# EAGLE design UP-Universaltasterschnittstelle (EAGLE 5.02)
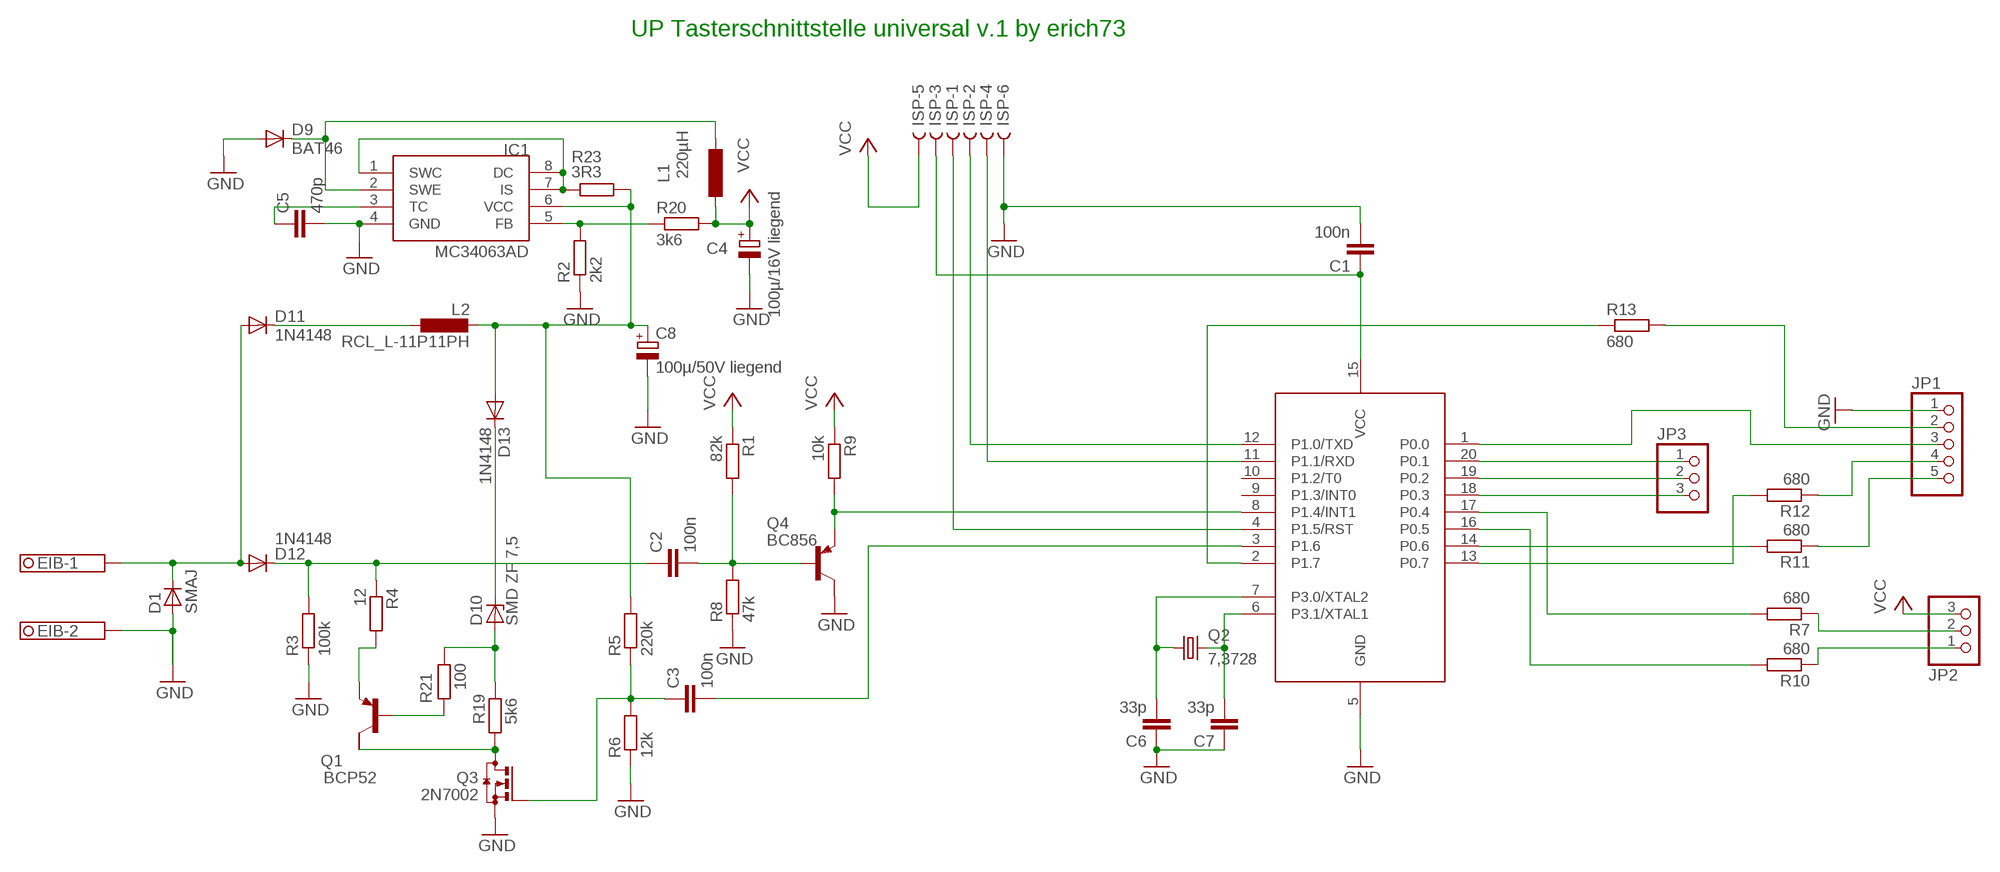
[diagram p0: schematic, sheet 1]

## Parts
C1  100n  C-EUC1206  [C1206]
C2  100n  C-EUC1206  [C1206]
C3  100n  C-EUC1206  [C1206]
C4  100µ/16V liegend  RCL_C_EU_H2-5X11  [2-5X11]
C5  470p  C-EUC1206  [C1206]
C6  33p  C-EUC0805  [C0805]
C7  33p  C-EUC0805  [C0805]
C8  100µ/50V liegend  RCL_C_EU_H3,5-8X13  [3,5-8X13]
D1  SMAJ  D-SMB  [SMB]
D9  BAT46  DIODE-MINIMELF  [MINIMELF]
D10  SMD ZF 7,5  ZPD  [MINIMELF]
D11  1N4148  DIODE-MINIMELF  [MINIMELF]
D12  1N4148  DIODE-MINIMELF  [MINIMELF]
D13  1N4148  DIODE-MINIMELF  [MINIMELF]
EIB  1751248  [1751248]
IC1  MC34063AD  [SOIC8]
IC2  LPC922FDH  [TSSOP20]
ISP-  6  [6]
JP1  PINHD-1X5_2.00  [1X05M]
JP2  PINHD-1X3_2.00  [1X03M]
JP3  PINHD-1X3_2.00  [1X03M]
L1  220µH  L-EU2200-11.43  [2200-11.43]
L2  RCL_L-11P11PH  [RCL_11PH]
Q1  BCP52  FZT753SMD  [SOT223]
Q2  7,3728  CRYSTAL_CRYSTALHC49S  [CRYSTAL_HC49/S]
Q3  2N7002  BSS123  [SOT23]
Q4  BC856  BC856ALT1SMD  [SOT23-BEC]
R1  82k  R-EU_R1206  [R1206]
R2  2k2  R-EU_R1206  [R1206]
R3  100k  R-EU_M1206  [M1206]
R4  12  R-EU_R1206  [R1206]
R5  220k  R-EU_R1206  [R1206]
R6  12k  R-EU_M1206  [M1206]
R7  680  R-EU_R0805  [R0805]
R8  47k  R-EU_M1206  [M1206]
R9  10k  R-EU_R1206  [R1206]
R10  680  R-EU_R0805  [R0805]
R11  680  R-EU_R0805  [R0805]
R12  680  R-EU_R0805  [R0805]
R13  680  R-EU_R0805  [R0805]
R19  5k6  R-EU_M1206  [M1206]
R20  3k6  R-EU_M1206  [M1206]
R21  100  R-EU_R1206  [R1206]
R23  3R3  R-EU_M1206  [M1206]

## Nets
GND: C1.2 C4.- C5.2 C6.1 C7.1 C8.- D1.2(A) D9.A EIB.2 IC1.4(GND) IC2.5(GND) ISP-.6 JP1.1 Q3.2(S) Q4.C R2.1 R3.1 R6.1 R8.1
N$1: C1.1 IC2.15(VCC) ISP-.3
N$2: IC2.4(P1.5/RST) ISP-.1
N$3: IC2.12(P1.0/TXD) ISP-.2
N$4: IC2.11(P1.1/RXD) ISP-.4
N$5: C7.2 IC2.6(P3.1/XTAL1) Q2.2
N$6: C6.2 IC2.7(P3.0/XTAL2) Q2.1
N$7: IC2.1(P0.0) JP1.3
N$8: IC2.20(P0.1) JP3.1
N$9: IC2.19(P0.2) JP3.2
N$10: IC2.18(P0.3) JP3.3
N$11: IC2.17(P0.4) R7.2
N$12: C8.+ D13.A IC1.6(VCC) L2.P$2 R5.2 R23.2
N$13: JP2.2 R7.1
N$14: IC2.16(P0.5) R10.2
N$15: IC2.14(P0.6) R11.2
N$16: IC2.13(P0.7) R12.2
N$17: JP2.1 R10.1
N$18: JP1.5 R11.1
N$19: IC2.8(P1.4/INT1) Q4.E R9.2
N$20: JP1.4 R12.1
N$21: IC2.2(P1.7) R13.1
N$22: JP1.2 R13.2
N$23: C2.2 Q4.B R1.2 R8.2
N$24: C3.2 IC2.3(P1.6)
N$25: C2.1 D12.C R3.2 R4.1
N$26: IC1.5(FB) R2.2 R20.1
N$27: D9.C IC1.2(SWE) L1.2
N$28: C5.1 IC1.3(TC)
N$34: C3.1 Q3.1(G) R5.1 R6.2
N$36: D11.C L2.P$1
N$37: Q1.2(C) Q3.3(D) R19.1
N$38: D10.A R19.2 R21.1
N$39: Q1.3(E) R4.2
N$40: Q1.1(B) R21.2
N$41: D10.C D13.C
N$51: D1.1(C) D11.A D12.A EIB.1
N$61: IC1.1(SWC) IC1.7(IS) IC1.8(DC) R23.1
VCC: C4.+ ISP-.5 JP2.3 L1.1 R1.1 R9.1 R20.2
Unconnected: IC2.9(P1.3/INT0) IC2.10(P1.2/T0) Q1.4(C/)

## Notes on the sheet
- UP Tasterschnittstelle universal v.1 by erich73

## Library data of the parts
C1-C3 C5-C7 = rcl:C-EU: CAPACITOR, European symbol
C4 C8 = LPC_Gira3:RCL_C_EU_H
D1 = semicon-smd-ipc:D-: DIODE unfilled
D9 D11-D13 = diode:DIODE-: DIODE
D10 = diode:ZPD: Z DIODE 500 mW
EIB = con-phoenix-350:1751248: MKDS 1/ 2-3,5 Printklemme Nennstrom: 10 A Bemessungsspannung: 160 V Raster: 3,5 mm Polzahl: 2 Montageart: Löten Anschlussart: Schraubanschluss Anschlussrichtung vom Leiter zur Platine: 0° Source: http://eshop.phoenixcontact.com .. 1751248.pdf
IC1 = mc34063:MC34063
IC2 = LPCGira:LPC922FDH
ISP- = con-leotronics:6
JP1 = pinhead2:PINHD-1X5: PIN HEADER
JP2 JP3 = pinhead2:PINHD-1X3: PIN HEADER
L1 = rcl:L-EU: INDUCTOR, European symbol
L2 = LPC_Gira3:RCL_L-11P
Q1 = transistor-pnp:FZT753SMD: PNP Transistor
Q2 = LPCGira:CRYSTAL_CRYSTAL: CRYSTAL
Q3 = transistor-small-signal:BSS123: N-CHANNEL MOS FET
Q4 = transistor-pnp:BC856*: PNP Transistror
R1-R13 R19-R21 R23 = rcl:R-EU_: RESISTOR, European symbol

## Board
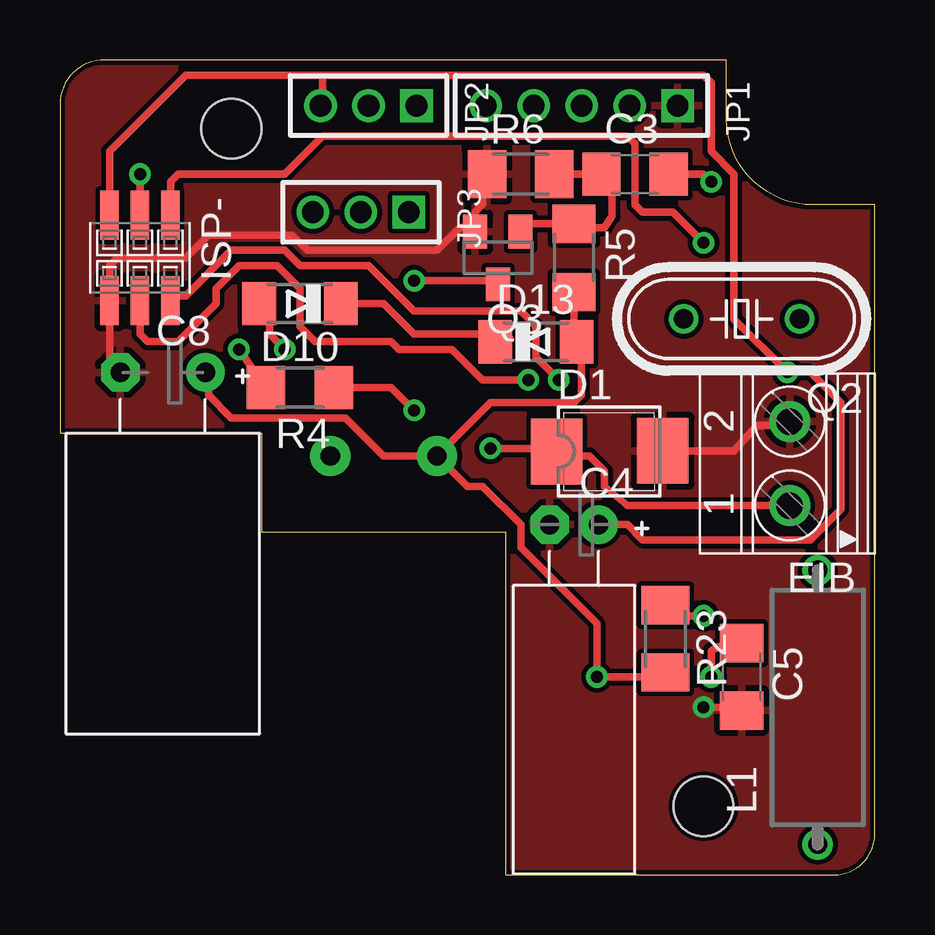
[diagram p1: board, top side]
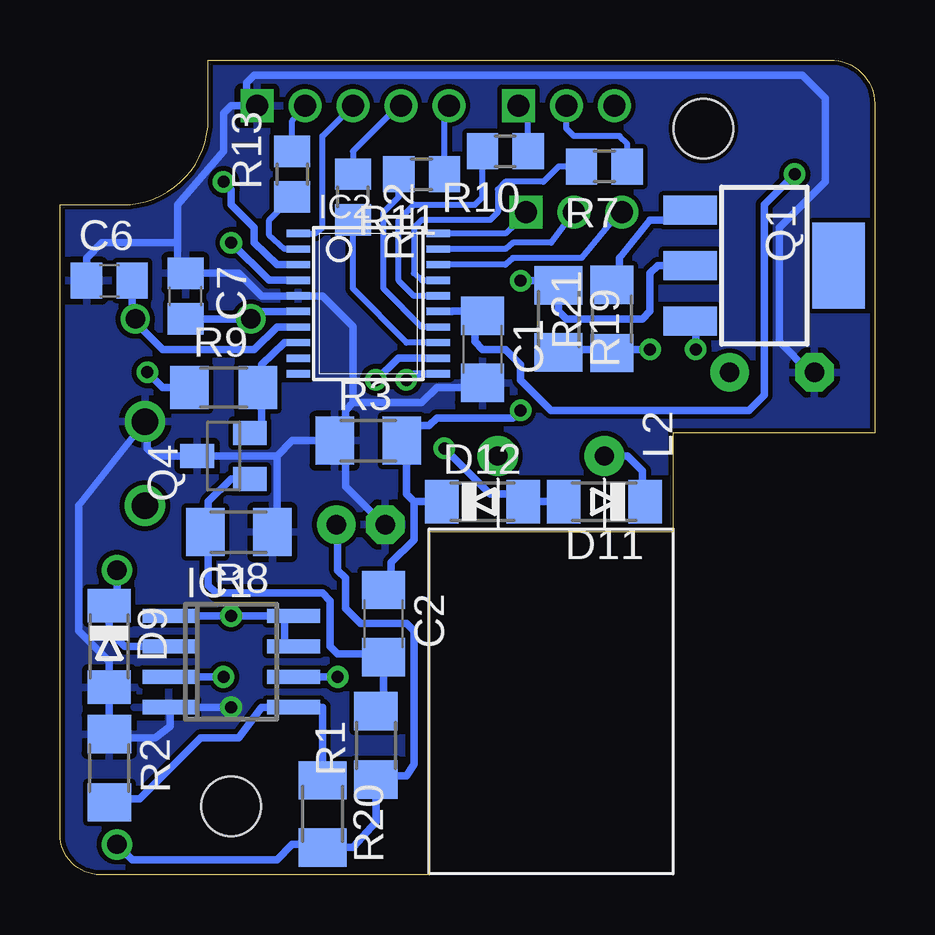
[diagram p2: board, bottom side, seen from below]

Size 33.97 x 33.97 mm. Coordinates in mm from the lower left corner, seen from the top.
Outline: 0.01,18.42 8.41,18.42 8.41,14.29 18.57,14.29 18.57,0 32.29,0.01 arc90 33.97,1.68 33.97,27.93 31.38,27.93 arc-90 27.78,31.53 27.78,33.97 1.69,33.97 arc90 0.01,31.97 0.01,18.42
Copper layers (1*16): Top 0.035mm / dielectric 1.5mm / Bottom 0.035mm
Design rules "ZWILLING": minimum track width 0.2mm, minimum drill 0.5mm, track to track 0.2mm, track to pad 0.2mm, pad to pad 0.2mm, via to via 0.2mm, smd to smd 0mil, copper to edge 0.2mm, drill to drill 0.2mm, minimum pad ring 0.2mm, minimum via ring 0.2mm, stop-mask expansion 0.1mm, vias tented up to drill 0mil, thermal gap 10mil
Holes 2.49 mm at 7.14,31.11 26.83,2.86

### Footprints (pad centres in the part's own frame; a part is rotated, then mirrored left to right if it is on the bottom)
C1206 = smd 1.6 x 1.8: 1 -1.4,0; 2 1.4,0
2-5X11 = drill 0.813 pad 1.6 round: + -1.02,0 | drill 0.813 pad 1.6 octagon: - 1.02,0
C0805 = smd 1.3 x 1.5: 1 -0.95,0; 2 0.95,0
3,5-8X13 = drill 0.813 pad 1.6 round: + -1.77,-0.31 | drill 0.813 pad 1.6 octagon: - 1.77,-0.31
SMB = smd 2.159 x 2.743: 1 -2.311,-0.127; 2 2.108,-0.102
MINIMELF = smd 1.4 x 1.8: A 1.7,0; C -1.7,0
1751248 = drill 1.1 pad 1.7 round: 1 -1.75,-0.1; 2 1.75,-0.1
SOIC8 = smd 0.6 x 2.2: 1 -1.905,-2.6; 2 -0.635,-2.6; 3 0.635,-2.6; 4 1.905,-2.6; 5 1.905,2.6; 6 0.635,2.6; 7 -0.635,2.6; 8 -1.905,2.6
TSSOP20 = smd 0.305 x 0.991: 1 -2.925,-2.918; 2 -2.275,-2.918; 3 -1.625,-2.918; 4 -0.975,-2.918; 5 -0.325,-2.918; 6 0.325,-2.918; 7 0.975,-2.918; 8 1.625,-2.918; 9 2.275,-2.918; 10 2.925,-2.918; 11 2.925,2.918; 12 2.275,2.918; 13 1.625,2.918; 14 0.975,2.918; 15 0.325,2.918; 16 -0.325,2.918; 17 -0.975,2.918; 18 -1.625,2.918; 19 -2.275,2.918; 20 -2.925,2.918
6 = smd 0.76 x 2.05: 1 -1.905,-1.78; 2 -1.905,1.78; 3 -0.635,-1.78; 4 -0.635,1.78; 5 0.635,-1.78; 6 0.635,1.78
1X05M = drill 0.914 square: 1 -4,0 | drill 0.914 round: 2 -2,0; 3 0,0; 4 2,0; 5 4,0
1X03M = drill 0.914 square: 1 -2,0 | drill 0.914 round: 2 0,0; 3 2,0
2200-11.43 = drill 0.8 pad 1.27 round: 1 -5.715,0; 2 5.715,0
RCL_11PH = drill 0.8 pad 1.676 round: P$1 -2.223,0; P$2 2.223,0
SOT223 = smd 1.219 x 2.235: 1 -2.311,-3.099; 2 0,-3.099; 3 2.311,-3.099 | smd 3.6 x 2.2: 4 0,3.099
CRYSTAL_HC49/S = drill 0.813 round: 1 -2.413,0; 2 2.413,0
SOT23 = smd 1 x 1.4: 1 -0.95,-1.1; 2 0.95,-1.1; 3 0,1.1
SOT23-BEC = smd 1 x 1.4: B -0.95,-1.1; C 0,1.1; E 0.95,-1.1
R1206 = smd 1.6 x 1.803: 1 -1.422,0; 2 1.422,0
M1206 = smd 1.6 x 2: 1 -1.4,0; 2 1.4,0
R0805 = smd 1.3 x 1.5: 1 -0.95,0; 2 0.95,0

### Placement (x,y rotation side)
C1  16.35,21.91 270 bottom
C2  20.48,10.48 270 bottom
C3  23.97,29.21 0 top
C4  21.43,14.61 180 top
C5  28.42,8.26 270 top
C6  31.91,24.77 0 bottom
C7  28.73,24.13 270 bottom
C8  4.29,20.64 180 top
D1  23.02,17.78 0 top
D9  31.91,9.53 270 bottom
D10  10,23.81 180 top
D11  11.27,15.56 180 bottom
D12  16.35,15.56 0 bottom
D13  19.84,22.23 0 top
EIB  30.32,17.14 90 top
IC1  26.83,8.89 270 bottom
IC2  21.11,23.81 270 bottom
ISP-  2.7,25.72 180 top
JP1  21.75,32.07 180 top
JP2  12.86,32.07 180 top
JP3  12.54,27.62 180 top
L1  31.59,6.99 90 top
L2  13.49,17.46 180 bottom
Q1  4.6,25.4 270 bottom
Q2  28.42,23.18 180 top
Q3  18.26,25.72 180 top
Q4  27.15,17.46 90 bottom
R1  20.8,5.4 90 bottom
R2  31.91,4.45 270 bottom
R3  21.11,18.1 0 bottom
R4  10,20.32 180 top
R5  21.43,25.72 270 top
R6  19.21,29.21 0 top
R7  11.27,29.53 180 bottom
R8  26.51,14.29 180 bottom
R9  27.15,20.32 0 bottom
R10  15.4,30.16 180 bottom
R11  18.89,29.21 180 bottom
R12  21.75,28.26 270 bottom
R13  24.29,29.21 90 bottom
R19  13.18,23.18 270 bottom
R20  23.02,2.54 270 bottom
R21  10.95,23.18 90 bottom
R23  25.24,9.84 270 top

### Tracks (layer width: path | path; a pad name or v marks a point on that pad's centre or on a via)
GND  (via drill 0.5)
  Top 0.305: 17.94,29.04 17.94,28.89 | Q3.2 17.3,26.99 | 17.3,26.99 17.3,27.62 17.62,27.94 17.62,28.26 17.94,29.04 | R6.1 17.94,29.21 17.94,29.04 | C8.- 2.06,21.58 ISP-.6 2.06,25.4 2.38,25.72 5.24,25.72 6.19,26.67 9.68,26.67 10.32,26.04 15.72,26.04 16.67,26.99 17.3,26.99 | D1.2 28.1,17.68 29.05,18.73 30.32,18.73 30.32,18.89 EIB.2 | v26.83,6.99 28.42,6.99 C5.2 28.42,6.67
  Bottom 0.305: 21.75,19.68 21.75,22.86 23.02,24.14 IC2.5 25.56,24.14 26.51,25.08 C7.1 29.05,25.08 29.05,26.35 | C6.1 32.86,25.72 32.23,26.35 29.05,26.35 | 29.05,26.35 29.05,27.94 27.15,30.16 27.15,31.75 26.83,32.07 26.19,32.07 | 31.91,7.94 31.91,8.89 33.18,10.16 33.18,15.4 EIB.2 30.32,18.89 30.32,17.78 30,17.46 Q4.C | Q4.C 28.1,17.46 | R8.1 24.92,14.29 24.92,17.46 | 24.92,17.46 Q4.C | C4.- 20.48,14.61 22.07,16.19 22.07,18.1 | 26.19,32.07 26.19,33.02 25.88,33.34 3.02,33.34 2.06,32.38 2.06,28.89 3.97,26.99 3.97,22.23 2.7,20.95 C8.- | 26.19,32.07 JP1.1 | 29.37,6.99 IC1.4 | 29.37,6.99 29.37,6.18 30,5.71 31.91,5.71 R2.1 31.91,7.94 | 31.91,7.94 D9.A | 29.37,6.99 v26.83,6.99 | 22.07,18.1 R3.1 24.29,18.1 24.92,17.46 | 22.07,18.1 22.07,19.37 21.75,19.68 | 21.75,19.68 18.89,19.68 18.26,20.32 16.35,20.32 C1.2
  pour Top: -0.16,33.97 34.13,33.97 34.13,1.91 34.13,0 -0.16,0
  pour Bottom: -0.16,33.97 34.13,33.97 34.13,3.17 34.13,0 -0.16,0
N$1  (via drill 0.5)
  Top 0.305: v3.33,29.21 ISP-.3
  Bottom 0.305: IC2.15 17.62,23.49 17.62,23.5 16.67,23.5 | 16.67,23.5 C1.1 | 16.67,23.5 16.67,22.23 16.35,21.91 15.4,21.91 14.76,21.27 14.76,20.64 13.49,19.37 5.24,19.37 4.6,20 4.6,27.94 v3.33,29.21
N$2  (via drill 0.5)
  Top 0.305: v26.83,26.35 25.56,27.62 24.29,27.62 23.97,27.94 23.97,30.48 23.65,30.8 10.95,30.8 9.37,29.21 4.92,29.21 4.6,28.89 ISP-.1
  Bottom 0.305: IC2.4 25.24,24.79 v26.83,26.35
N$3  (via drill 0.5)
  Top 0.305: v20.8,20.64 19.84,21.59 19.84,22.86 19.21,23.5 14.76,23.5 12.86,25.4 10,25.4 9.37,26.04 7.14,26.04 5.24,24.13 4.6,24.13 ISP-.2
  Bottom 0.305: IC2.12 19.84,21.54 v20.8,20.64
N$4  (via drill 0.5)
  Top 0.305: v19.53,20.64 17.62,20.64 16.35,21.91 14.13,21.91 13.81,22.23 10.64,22.23 10,22.86 10,24.45 9.05,25.4 7.46,25.4 6.51,24.45 6.51,23.81 4.92,22.23 3.65,22.23 3.33,22.54 ISP-.4 3.33,24.13
  Bottom 0.305: IC2.11 19.21,20.89 v19.53,20.64
N$5
  Bottom 0.254: 25.88,23.18 Q2.2 | C7.2
  Bottom 0.305: IC2.6 25.56,23.49 25.88,23.18 | Q2.2 C7.2
N$6
  Bottom 0.254: 30.64,22.86 Q2.1
  Bottom 0.305: C6.2 30.96,23.18 30.64,22.86 29.69,21.91 25.88,21.91 24.92,22.84 IC2.7
N$7
  Bottom 0.254: IC2.1 23.34,26.74 23.02,26.99 23.02,30.8 JP1.3
N$8
  Bottom 0.254: IC2.20 15.4,26.74 14.45,27.62 JP3.1
N$9
  Bottom 0.254: 18.26,26.09 IC2.19 15.4,26.09 15.08,26.35 13.49,26.35 JP3.2
N$10
  Bottom 0.254: IC2.18 15.4,25.44 15.08,25.72 12.22,25.72 10.64,27.62 JP3.3
N$11
  Bottom 0.254: IC2.17 18.89,24.79 19.21,25.08 19.21,26.99 18.89,27.3 16.03,27.3 15.72,27.62 15.72,28.57 15.4,28.89 13.81,28.89 13.18,29.53 R7.2
N$12  (via drill 0.5)
  Top 0.305: R5.2 21.43,22.23 D13.A 21.75,22.23 21.75,20 21.43,19.68 17.94,19.68 L2.P$2 | R23.2 25.24,8.26 v22.38,8.26 22.38,10.48 19.21,13.65 19.21,14.61 17.62,16.19 16.99,16.19 L2.P$2 | L2.P$2 13.49,17.46 11.91,19.05 7.14,19.05 6.19,20 6.19,20.95 | 6.19,20.95 | 6.19,20.95 C8.+
  Bottom 0.305: v22.38,8.26 IC1.6
N$13
  Bottom 0.254: R7.1 10.32,30.48 10.64,30.8 12.54,30.8 12.86,31.11 JP2.2
N$14
  Bottom 0.254: IC2.16 19.21,24.13 19.84,24.77 19.84,27.3 19.21,27.94 16.67,27.94 16.35,28.26 R10.2
N$15
  Bottom 0.254: IC2.14 18.89,22.84 20.48,24.45 20.48,27.62 19.84,28.26 19.84,28.57 R11.2
N$16
  Bottom 0.254: IC2.13 19.53,22.19 21.75,24.45 R12.2
N$17
  Bottom 0.254: R10.1 14.45,31.75 JP2.1
N$18
  Bottom 0.254: R11.1 17.94,29.52 17.94,31.43 17.62,32.07 JP1.5
N$19
  Bottom 0.305: IC2.8 24.61,22.19 25.56,21.27 25.56,19.37 | 25.56,19.37 R9.2 | Q4.E 25.56,18.41 25.56,19.37
N$20
  Bottom 0.254: R12.1 21.75,30.16 19.84,32.07 JP1.4
N$21
  Bottom 0.254: IC2.2 24.61,26.09 25.24,26.67 25.24,27.3 R13.1
N$22
  Bottom 0.254: JP1.2 23.65,32.07 24.29,31.43 R13.2
N$23
  Bottom 0.305: Q4.B 26.83,16.51 27.78,15.56 27.78,14.29 | 27.78,14.29 R8.2 | 27.78,14.29 27.78,12.06 27.46,11.75 23.02,11.75 22.7,11.43 22.7,9.53 22.38,9.21 20.8,9.21 C2.2 20.48,7.3 20.48,6.82 R1.2 20.48,6.67
N$24  (via drill 0.5)
  Top 0.305: v27.15,28.89 26.83,29.21 C3.2
  Bottom 0.305: IC2.3 24.92,25.44 25.88,26.35 25.88,26.99 26.83,27.94 26.83,28.57 v27.15,28.89
N$25  (via drill 0.5)
  Top 0.305: R4.1 13.81,20.32 v14.76,19.37
  Bottom 0.305: C2.1 20.16,11.88 20.16,13.02 19.21,13.97 19.21,15.56 | 19.21,15.56 D12.C | 19.21,15.56 19.53,15.88 19.53,18.1 R3.2 19.84,18.1 19.84,18.73 18.57,18.73 18.26,19.05 15.08,19.05 v14.76,19.37
N$26
  Bottom 0.305: R2.2 31.91,3.17 30.64,3.17 28.1,5.71 26.51,5.71 25.56,6.99 IC1.5 23.02,6.99 R20.1 23.02,3.81
N$27
  Bottom 0.305: IC1.2 31.27,9.53 31.91,10.16 D9.C 31.59,11.11 L1.2
N$28  (via drill 0.5)
  Top 0.305: C5.1 28.42,9.53 27.46,9.53 27.15,9.34 v27.15,8.26
  Bottom 0.305: v27.15,8.26 29.05,8.26 | 29.05,8.26 29.37,8.26 | 29.05,8.26 IC1.3
N$34
  Top 0.305: 23.02,29.21 C3.1 | R5.1 22.07,27.3 | 23.02,29.21 R6.2 | R5.1 21.43,26.99 22.7,26.99 23.02,27.46 23.02,29.21 | 19.21,27.14 19.21,26.99 | Q3.1 19.21,27.14 | R5.1 19.21,27.14
N$36
  Bottom 0.305: D11.C 9.68,15.56 9.68,16.83 10.32,17.46 L2.P$1
N$37  (via drill 0.5)
  Top 0.305: v14.76,24.77 18.26,24.77 Q3.3
  Bottom 0.305: Q1.2 9.05,25.4 9.37,25.08 9.37,23.5 9.68,23.18 12.86,23.18 13.18,23.5 R19.1 13.81,24.77 v14.76,24.77
N$38  (via drill 0.5)
  Top 0.305: v9.37,21.91 8.73,22.54 8.73,23.81 D10.A
  Bottom 0.305: v9.37,21.91 10.95,21.91 | 10.95,21.91 R21.1 | 10.95,21.91 13.18,21.91 R19.2
N$39  (via drill 0.5)
  Top 0.305: R4.2 v7.46,21.91
  Bottom 0.305: Q1.3 7.46,22.77 v7.46,21.91
N$40
  Bottom 0.305: Q1.1 7.78,27.39 8.1,27.3 9.37,27.3 10.64,25.72 10.64,24.6 R21.2
N$41
  Top 0.305: D10.C 13.49,23.81 14.76,22.54 18.57,22.54 18.78,22.34 D13.C 18.57,21.91
N$51  (via drill 0.5)
  Top 0.305: EIB.1 23.65,15.39 22.7,16.19 22.7,16.83 22.07,17.46 20.48,17.46 20.48,17.65 | 20.48,17.65 D1.1 | 20.48,17.65 20.48,17.78 v17.94,17.78
  Bottom 0.305: D11.A D12.A 14.76,15.88 16.03,15.88 v17.94,17.78
N$61  (via drill 0.5)
  Top 0.305: v26.83,10.79 25.24,10.79 R23.1
  Bottom 0.305: 24.61,10.79 v26.83,10.79 IC1.1 | 24.61,10.79 IC1.8 | IC1.7 24.61,9.53 24.61,10.79
VCC  (via drill 0.5)
  Top 0.305: JP2.3 10.95,32.07 10.95,33.34 | 10.95,33.34 26.83,33.34 27.15,33.02 27.15,30.16 28.1,29.21 28.1,23.18 v30.32,20.95 31.27,20.95 32.54,19.68 32.54,15.24 31.27,13.97 24.29,13.97 23.65,14.61 C4.+ 22.38,14.61 | 10.95,33.34 5.24,33.34 2.06,30.16 ISP-.5
  Bottom 0.305: R9.1 29.69,20.32 v30.32,20.95 | L1.1 30.96,0.64 24.92,0.64 24.29,1.27 23.02,1.27 R20.2 21.75,1.14 20.8,2.22 R1.1 20.8,4.13 19.53,4.13 19.21,4.61 19.21,10.16 19.53,10.48 21.43,10.48 22.07,11.11 22.07,12.38 22.38,12.7 22.38,14.61 C4.+